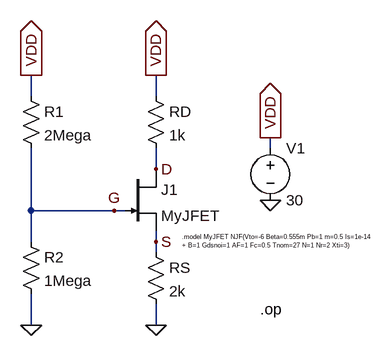
[diagram p0: schematic 006 JFET.asc]
006 JFET.asc, the LTspice schematic file:
Version 4
SHEET 1 2736 680
WIRE -16 -80 -16 -112
WIRE 176 -80 176 -112
WIRE 352 0 352 -16
WIRE 176 32 176 0
WIRE -16 96 -16 0
WIRE 112 96 -16 96
WIRE 128 96 112 96
WIRE -16 144 -16 96
WIRE 176 144 176 128
WIRE 176 160 176 144
WIRE -16 272 -16 224
WIRE 176 272 176 240
FLAG -16 272 0
FLAG 352 80 0
FLAG 176 32 D
FLAG 112 96 G
FLAG 176 272 0
FLAG 352 -16 VDD
IOPIN 352 -16 Out
FLAG 176 -112 VDD
IOPIN 176 -112 Out
FLAG 176 144 S
FLAG -16 -112 VDD
IOPIN -16 -112 Out
SYMBOL voltage 352 -16 R0
SYMATTR InstName V1
SYMATTR Value 30
SYMBOL njf 128 32 R0
SYMATTR InstName J1
SYMATTR Value MyJFET
SYMBOL res -32 128 R0
SYMATTR InstName R2
SYMATTR Value 1Mega
SYMBOL res 160 -96 R0
SYMATTR InstName RD
SYMATTR Value 1k
SYMBOL res 160 144 R0
SYMATTR InstName RS
SYMATTR Value 2k
SYMBOL res -32 -96 R0
SYMATTR InstName R1
SYMATTR Value 2Mega
TEXT 216 136 Left 0 !.model MyJFET NJF(Vto=-6 Beta=0.555m Pb=1 m=0.5 Is=1e-14\n+ B=1 Gdsnoi=1 AF=1 Fc=0.5 Tnom=27 N=1 Nr=2 Xti=3)
TEXT 336 248 Left 2 !.op

The netlist it stands for:
* 006 JFET.asc
V1 VDD 0 30
J1 D G S MyJFET
R2 G 0 1Mega
RD VDD D 1k
RS S 0 2k
R1 VDD G 2Mega
.model NJF NJF
.model PJF PJF
.lib standard.jft
.model MyJFET NJF(Vto=-6 Beta=0.555m Pb=1 m=0.5 Is=1e-14
+ B=1 Gdsnoi=1 AF=1 Fc=0.5 Tnom=27 N=1 Nr=2 Xti=3)
.op
.backanno
.end